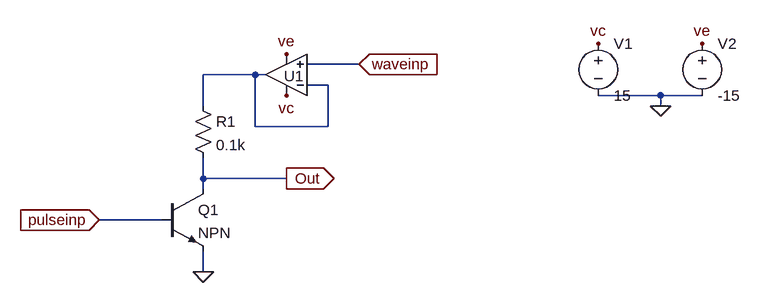
[diagram p0: schematic Symbol_circuit.asc]
Symbol_circuit.asc, the LTspice schematic file:
Version 4.1
SHEET 1 880 680
WIRE 224 -48 144 -48
WIRE 64 -32 -16 -32
WIRE 80 -32 64 -32
WIRE 176 -16 144 -16
WIRE 688 0 592 0
WIRE 752 0 688 0
WIRE -16 16 -16 -32
WIRE 688 16 688 0
WIRE 64 48 64 -32
WIRE 176 48 176 -16
WIRE 176 48 64 48
WIRE -16 128 -16 96
WIRE 112 128 -16 128
WIRE -16 144 -16 128
WIRE -80 192 -176 192
WIRE -16 272 -16 240
FLAG 224 -48 waveinp
IOPIN 224 -48 In
FLAG -176 192 pulseinp
IOPIN -176 192 In
FLAG 112 128 Out
IOPIN 112 128 Out
FLAG -16 272 0
FLAG 688 16 0
FLAG 592 -80 vc
FLAG 752 -80 ve
FLAG 112 -64 ve
FLAG 112 0 vc
SYMBOL OpAmps\\UniversalOpAmp2 112 -32 R180
WINDOW 0 -27 -2 Left 2
SYMATTR InstName U1
SYMBOL npn -80 144 R0
SYMATTR InstName Q1
SYMBOL res -32 0 R0
SYMATTR InstName R1
SYMATTR Value 0.1k
SYMBOL voltage 592 -96 R0
WINDOW 123 0 0 Left 0
WINDOW 39 0 0 Left 0
SYMATTR InstName V1
SYMATTR Value 15
SYMBOL voltage 752 -96 R0
WINDOW 123 0 0 Left 0
WINDOW 39 0 0 Left 0
SYMATTR InstName V2
SYMATTR Value -15

The netlist it stands for:
* Symbol_circuit.asc
X§U1 waveinp N001 vc ve N001 level2 Avol=1Meg GBW=10Meg Slew=10Meg Ilimit=25m Rail=0 Vos=0 En=0 Enk=0 In=0 Ink=0 Rin=500Meg  ; pins In+ In- V+ V- OUT
Q1 Out pulseinp 0 0 NPN
R1 N001 Out 0.1k
V1 vc 0 15
V2 ve 0 -15
.model NPN NPN
.model PNP PNP
.lib standard.bjt
.lib UniversalOpAmp2.lib
.backanno
.end